# EAGLE design motor board (EAGLE 7.1.0)
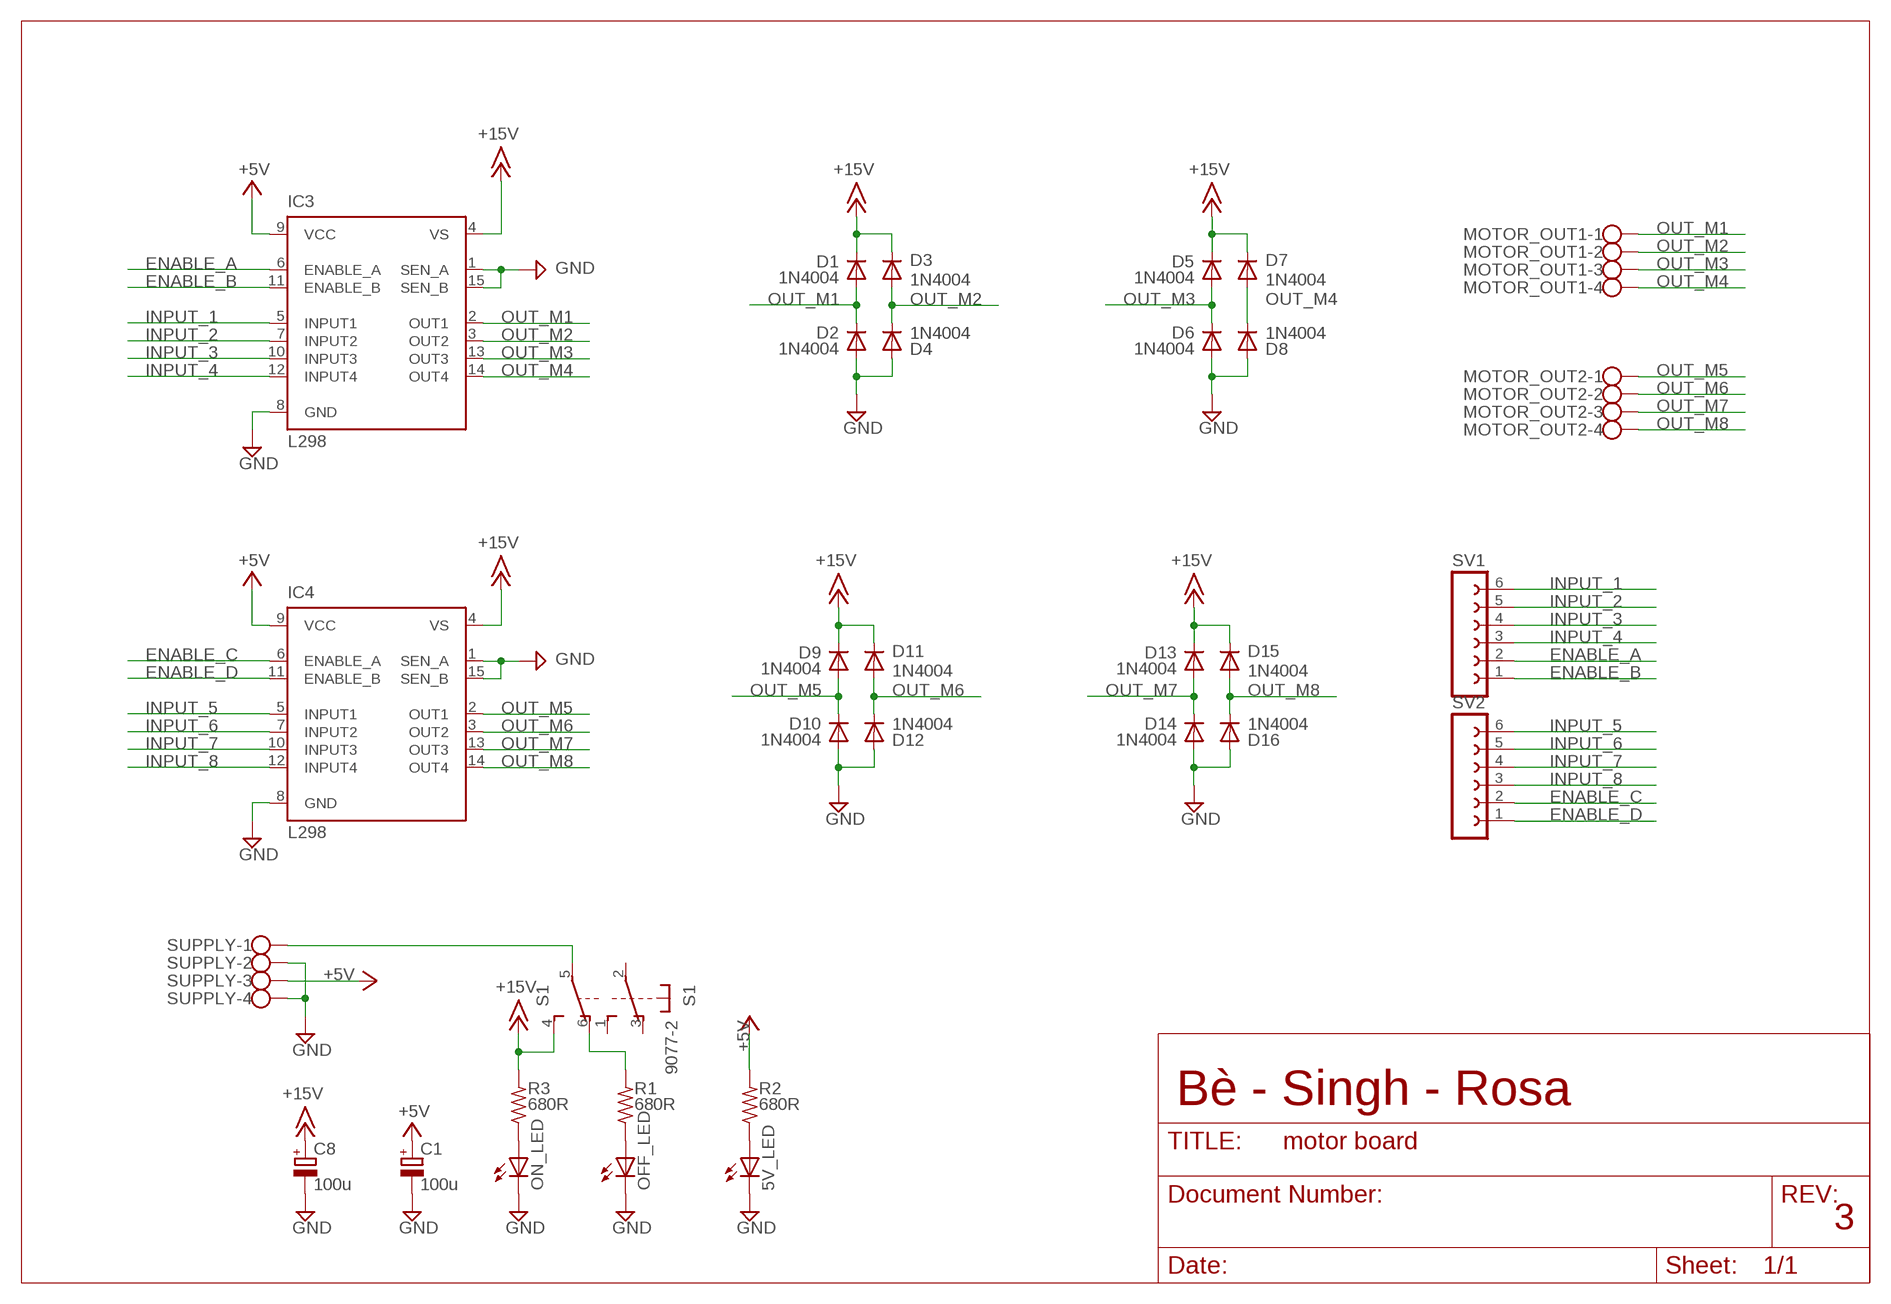
[diagram p0: schematic, sheet 1]

## Parts
5V_LED  LED5MM  [LED5MM]
C1  100u  CPOL-EUE2.5-7  [E2,5-7]
C8  100u  CPOL-EUE3.5-8  [E3,5-8]
D1  1N4004  [DO41-10]
D2  1N4004  [DO41-10]
D3  1N4004  [DO41-10]
D4  1N4004  [DO41-10]
D5  1N4004  [DO41-10]
D6  1N4004  [DO41-10]
D7  1N4004  [DO41-10]
D8  1N4004  [DO41-10]
D9  1N4004  [DO41-10]
D10  1N4004  [DO41-10]
D11  1N4004  [DO41-10]
D12  1N4004  [DO41-10]
D13  1N4004  [DO41-10]
D14  1N4004  [DO41-10]
D15  1N4004  [DO41-10]
D16  1N4004  [DO41-10]
IC3  L298  [MULTIWATT-15]
IC4  L298  [MULTIWATT-15]
MOTOR_OUT1  W237-4  [W237-4]
MOTOR_OUT2  W237-4  [W237-4]
OFF_LED  LED5MM  [LED5MM]
ON_LED  LED5MM  [LED5MM]
R1  680R  R-US_0207/10  [0207/10]
R2  680R  R-US_0207/10  [0207/10]
R3  680R  R-US_0207/10  [0207/10]
S1  9077-2  [9077-2]
SUPPLY  W237-4  [W237-4]
SV1  FE06-1  [FE06]
SV2  FE06-1  [FE06]

## Nets
+5V: C1.+ IC3.9(VCC) IC4.9(VCC) R2.2 SUPPLY.3
+15V: C8.+ D1.C D3.C D5.C D7.C D9.C D11.C D13.C D15.C IC3.4(VS) IC4.4(VS) R3.2 S1.4(2:S)
ENABLE_A: IC3.6(ENABLE_A) SV1.2
ENABLE_B: IC3.11(ENABLE_B) SV1.1
ENABLE_C: IC4.6(ENABLE_A) SV2.2
ENABLE_D: IC4.11(ENABLE_B) SV2.1
GND: 5V_LED.K(C) C1.- C8.- D2.A D4.A D6.A D8.A D10.A D12.A D14.A D16.A IC3.1(SEN_A) IC3.8(GND) IC3.15(SEN_B) IC4.1(SEN_A) IC4.8(GND) IC4.15(SEN_B) OFF_LED.K(C) ON_LED.K(C) SUPPLY.2 SUPPLY.4
INPUT_1: IC3.5(INPUT1) SV1.6
INPUT_2: IC3.7(INPUT2) SV1.5
INPUT_3: IC3.10(INPUT3) SV1.4
INPUT_4: IC3.12(INPUT4) SV1.3
INPUT_5: IC4.5(INPUT1) SV2.6
INPUT_6: IC4.7(INPUT2) SV2.5
INPUT_7: IC4.10(INPUT3) SV2.4
INPUT_8: IC4.12(INPUT4) SV2.3
N$1: ON_LED.A R3.1
N$2: OFF_LED.A R1.1
N$3: 5V_LED.A R2.1
N$4: S1.5(2:P) SUPPLY.1
N$5: R1.2 S1.6(2:O)
OUT_M1: D1.A D2.C IC3.2(OUT1) MOTOR_OUT1.1
OUT_M2: D3.A D4.C IC3.3(OUT2) MOTOR_OUT1.2
OUT_M3: D5.A D6.C IC3.13(OUT3) MOTOR_OUT1.3
OUT_M4: D7.A D8.C IC3.14(OUT4) MOTOR_OUT1.4
OUT_M5: D9.A D10.C IC4.2(OUT1) MOTOR_OUT2.1
OUT_M6: D11.A D12.C IC4.3(OUT2) MOTOR_OUT2.2
OUT_M7: D13.A D14.C IC4.13(OUT3) MOTOR_OUT2.3
OUT_M8: D15.A D16.C IC4.14(OUT4) MOTOR_OUT2.4
Unconnected: S1.1(1:S) S1.2(1:P) S1.3(1:O)

## Notes on the sheet
- Bè - Singh - Rosa
- 3

## Library data of the parts
5V_LED OFF_LED ON_LED = led:LED: LED OSRAM: - CHIPLED LG R971, LG N971, LY N971, LG Q971, LY Q971, LO R971, LY R971 LH N974, LH R974 LS Q976, LO Q976, LY Q976 LO Q996 - Hyper CHIPLED LW Q18S LB Q993, LB Q99A, LB R99A - SideLED LS A670, LO A670, LY A670, LG A670, LP A670 LB A673, LV A673, LT A673, LW A673 LH A674 LY A675 LS A676, LA A676, LO A676, LY A676, LW A676 LS A679, LY A679, LG A679 - Hyper Micro SIDELED® LS Y876, LA Y876, LO Y876, LY Y876 LT Y87S - SmartLED LW L88C, LW L88S LB L89C, LB L89S, LG L890 LS L89K, LO L89K, LY L89K LS L896, LA L896, LO L896, LY L896 - TOPLED LS T670, LO T670, LY T670, LG T670, LP T670 LSG T670, LSP T670, LSY T670, LOP T670, LYG T670 LG T671, LOG T671, LSG T671 LB T673, LV T673, LT T673, LW T673 LH T674 LS T676, LA T676, LO T676, LY T676, LB T676, LH T676, LSB T676, LW T676 LB T67C, LV T67C, LT T67C, LS T67K, LO T67K, LY T67K, LW E67C LS E67B, LA E67B, LO E67B, LY E67B, LB E67C, LV E67C, LT E67C LW T67C LS T679, LY T679, LG T679 LS T770, LO T770, LY T770, LG T770, LP T770 LB T773, LV T773, LT T773, LW T773 LH T774 LS E675, LA E675, LY E675, LS T675 LS T776, LA T776, LO T776, LY T776, LB T776 LHGB T686 LT T68C, LB T68C - Hyper Mini TOPLED® LB M676 - Mini TOPLED Santana® LG M470 LS M47K, LO M47K, LY M47K Source: http://www.osram.convergy.de LUXEON: - LUMILED® LXK2-PW12-R00, LXK2-PW12-S00, LXK2-PW14-U00, LXK2-PW14-V00 LXK2-PM12-R00, LXK2-PM12-S00, LXK2-PM14-U00 LXK2-PE12-Q00, LXK2-PE12-R00, LXK2-PE12-S00, LXK2-PE14-T00, LXK2-PE14-U00 LXK2-PB12-K00, LXK2-PB12-L00, LXK2-PB12-M00, LXK2-PB14-N00, LXK2-PB14-P00, LXK2-PB14-Q00 LXK2-PR12-L00, LXK2-PR12-M00, LXK2-PR14-Q00, LXK2-PR14-R00 LXK2-PD12-Q00, LXK2-PD12-R00, LXK2-PD12-S00 LXK2-PH12-R00, LXK2-PH12-S00 LXK2-PL12-P00, LXK2-PL12-Q00, LXK2-PL12-R00 Source: www.luxeon.com KINGBRIGHT: KA-3528ASYC Source: www.kingbright.com
C1 = ITIS:CPOL-EU: POLARIZED CAPACITOR, European symbol
C8 = rcl:CPOL-EU: POLARIZED CAPACITOR, European symbol
D1-D16 = ITIS:1N4004: DIODE general purpose rectifier, 1 A
IC3 IC4 = st-microelectronics:L298: DUAL FULL-BRIDGE DRIVER
MOTOR_OUT1 MOTOR_OUT2 SUPPLY = con-wago-500:W237-4: WAGO SCREW CLAMP; OC_FARNELL: unknown; OC_NEWARK: unknown
R1-R3 = resistor:R-US_: RESISTOR, American symbol
S1 = switch-misc:9077-2: MARQUARDT SWITCH 9077.0200 Distributor: Buerklin <https://www.buerklin.com/default.asp?event=ShowArtikel%2812G2822%29&l=d&jump=ArtNr_12G2822>
SV1 SV2 = con-lsta:FE06-1: FEMALE HEADER; OC_FARNELL: unknown; OC_NEWARK: unknown

## Board
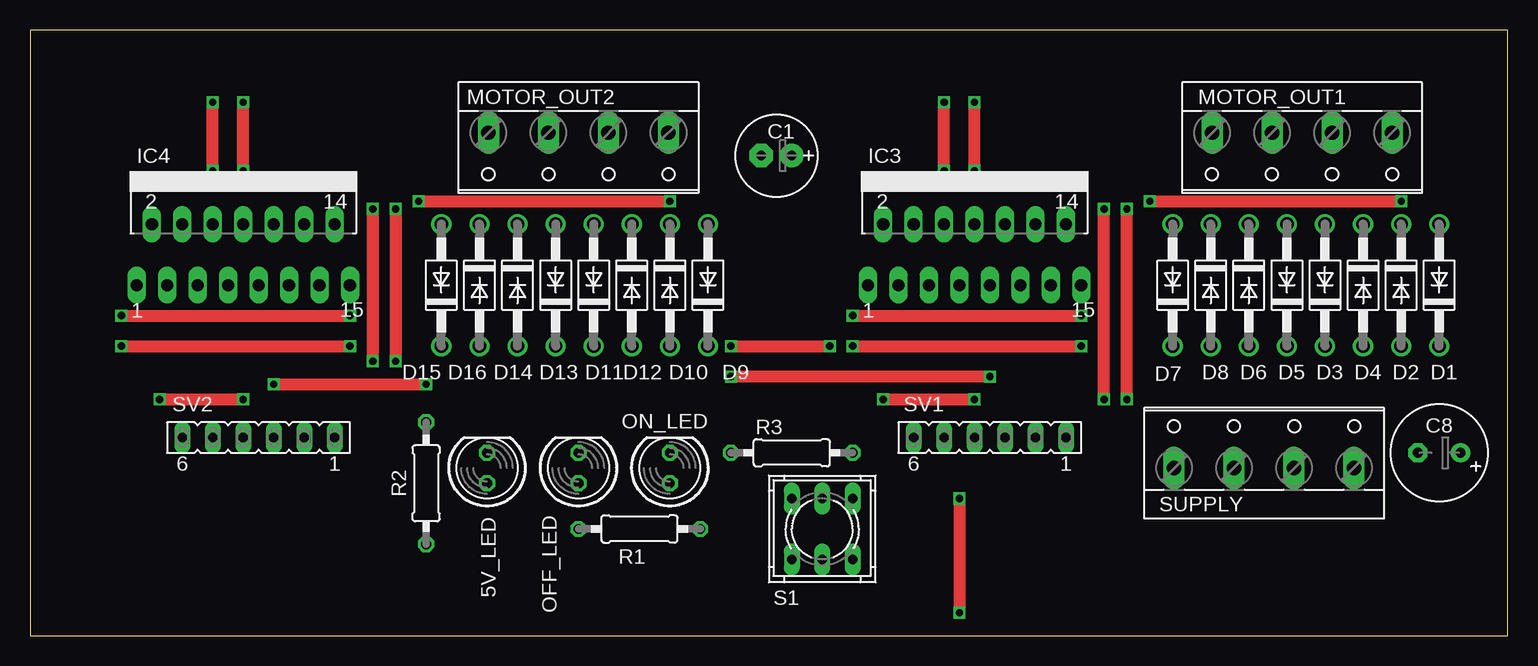
[diagram p1: board, top side]
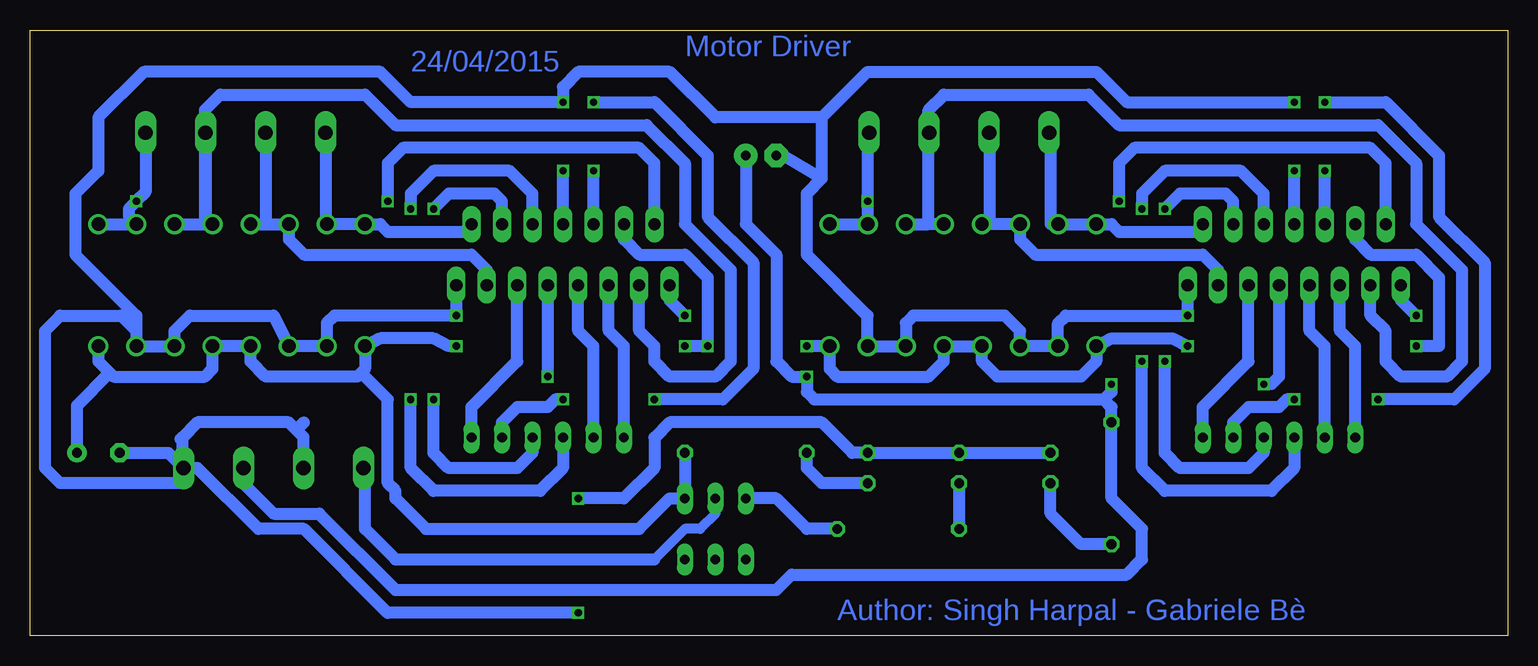
[diagram p2: board, bottom side, seen from below]

Size 123.17 x 50.47 mm. Coordinates in mm from the lower left corner, seen from the top.
Outline: 0,0 123.17,0 123.17,50.47 0,50.47 0,0
Copper layers (1*16): Top 0.035mm / dielectric 1.5mm / Bottom 0.035mm
Design rules "default": minimum track width 10mil, minimum drill 24mil, track to track 8mil, track to pad 8mil, pad to pad 8mil, via to via 8mil, smd to smd 8mil, copper to edge 40mil, drill to drill 8mil, minimum pad ring 10mil, minimum via ring 8mil, stop-mask expansion 4mil, vias tented up to drill 0mil, thermal gap 10mil

### Footprints (pad centres in the part's own frame; a part is rotated, then mirrored left to right if it is on the bottom)
LED5MM = drill 0.813 octagon: A -1.27,0; K 1.27,0
E2,5-7 = drill 0.813 pad 1.93: + -1.27,0 | drill 0.813 pad 1.93 octagon: - 1.27,0
E3,5-8 = drill 0.813 pad 1.6: + -1.778,0 | drill 0.813 pad 1.6 octagon: - 1.778,0
DO41-10 = drill 1.118: A 5.08,0; C -5.08,0
MULTIWATT-15 = drill 1.016 long: 1 -8.89,-7.62; 2 -7.62,-2.54; 3 -6.35,-7.62; 4 -5.08,-2.54; 5 -3.81,-7.62; 6 -2.54,-2.54; 7 -1.27,-7.62; 8 0,-2.54; 9 1.27,-7.62; 10 2.54,-2.54; 11 3.81,-7.62; 12 5.08,-2.54; 13 6.35,-7.62; 14 7.62,-2.54; 15 8.89,-7.62
W237-4 = drill 1.194 long: 1 -7.5,-1.27; 2 -2.5,-1.27; 3 2.5,-1.27; 4 7.5,-1.27
0207/10 = drill 0.813 octagon: 1 -5.08,0; 2 5.08,0
9077-2 = drill 0.813 long: 1 -2.54,2.54; 2 0,2.54; 3 2.54,2.54; 4 -2.54,-2.54; 5 0,-2.54; 6 2.54,-2.54
FE06 = drill 0.813 long: 1 -6.35,0; 2 -3.81,0; 3 -1.27,0; 4 1.27,0; 5 3.81,0; 6 6.35,0

### Placement (x,y rotation side)
5V_LED  38.1,13.97 90 top
C1  62.23,40.01 180 top
C8  117.47,15.24 180 top
D1  117.47,29.21 90 top
D2  114.3,29.21 270 top
D3  107.95,29.21 90 top
D4  111.12,29.21 270 top
D5  104.78,29.21 90 top
D6  101.6,29.21 270 top
D7  95.25,29.21 90 top
D8  98.42,29.21 270 top
D9  56.52,29.21 90 top
D10  53.34,29.21 270 top
D11  46.99,29.21 90 top
D12  50.16,29.21 270 top
D13  43.81,29.21 90 top
D14  40.64,29.21 270 top
D15  34.29,29.21 90 top
D16  37.47,29.21 270 top
IC3  78.74,36.83 0 top
IC4  17.78,36.83 0 top
MOTOR_OUT1  106.05,40.64 180 top
MOTOR_OUT2  45.72,40.64 180 top
OFF_LED  45.72,13.97 90 top
ON_LED  53.34,13.97 90 top
R1  50.8,8.89 0 top
R2  33.02,12.7 90 top
R3  63.5,15.24 0 top
S1  66.04,8.89 180 top
SUPPLY  102.87,15.24 0 top
SV1  80.01,16.51 180 top
SV2  19.05,16.51 180 top

### Tracks (layer width: path | path; a pad name or v marks a point on that pad's centre or on a via)
+5V  (via drill 0.6)
  Top 1.016: v20.32,20.95 v33.02,20.95 | v80.01,21.59 v58.42,21.59
  Bottom 1.016: IC4.9 19.05,21.59 19.68,20.95 v20.32,20.95 | IC3.9 v80.01,21.59 | 33.66,19.68 57.78,19.68 58.42,20.32 v58.42,21.59 59.69,21.59 60.96,22.86 60.96,31.75 63.5,34.29 C1.+ | 33.66,19.68 33.02,20.32 v33.02,20.95 | SUPPLY.3 105.37,12.66 102.87,10.16 99.06,10.16 92.71,3.81 60.96,3.81 59.69,5.08 31.75,5.08 30.48,6.35 30.48,8.89 33.02,11.43 R2.2 33.02,19.05 33.66,19.68
+15V  (via drill 0.6)
  Top 1.016: v7.62,24.13 v26.67,24.13 | v68.58,24.13 v87.63,24.13 | v58.42,24.13 v66.67,24.13
  Bottom 1.016: IC4.4 12.7,33.02 11.43,31.75 7.62,31.75 5.71,29.84 5.71,24.13 v7.62,24.13 | v26.67,24.13 27.94,24.77 33.02,24.77 D15.C 34.29,22.86 35.56,21.59 42.55,21.59 43.81,22.86 D13.C D11.C 46.99,22.86 48.26,21.59 55.88,21.59 56.52,22.23 D9.C v58.42,24.13 | 95.57,21.91 95.25,22.23 D7.C 93.98,24.77 89.53,24.77 88.27,24.13 v87.63,24.13 | 95.57,21.91 95.89,21.59 103.5,21.59 104.78,22.86 D5.C D3.C 107.95,22.23 108.58,21.59 116.2,21.59 116.52,21.91 | D1.C 117.47,22.86 116.52,21.91 | IC3.4 73.66,33.02 72.39,31.75 68.58,31.75 66.67,29.84 v66.67,24.13 v68.58,24.13 | 95.57,21.91 93.34,19.68 93.34,12.7 92.71,12.06 92.71,11.43 90.17,8.89 72.39,8.89 69.85,11.43 S1.4 R3.2 | C8.+ 119.25,19.18 116.52,21.91
ENABLE_A  (via drill 0.6)
  Top 1.016: v76.2,38.73 v76.2,44.45 | v71.12,19.68 v78.74,19.68
  Bottom 1.016: IC3.6 v76.2,38.73 | v76.2,44.45 71.12,44.45 66.67,40.01 66.67,34.92 62.87,31.11 62.87,22.23 65.41,19.68 v71.12,19.68 | v78.74,19.68 79.38,19.68 80.01,19.05 82.55,19.05 83.82,17.78 SV1.2
ENABLE_B
  Bottom 1.016: SV1.1 86.36,19.05 82.55,22.86 IC3.11
ENABLE_C  (via drill 0.6)
  Top 1.016: v15.24,38.73 v15.24,44.45 | v10.79,19.68 v17.78,19.68
  Bottom 1.016: IC4.6 v15.24,38.73 | v15.24,44.45 10.16,44.45 5.71,40.01 5.71,34.92 1.91,31.11 1.91,22.23 4.45,19.68 v10.79,19.68 | v17.78,19.68 18.41,19.68 19.05,19.05 21.59,19.05 22.86,17.78 SV2.2
ENABLE_D
  Bottom 1.016: SV2.1 25.4,19.05 21.59,22.86 IC4.11
GND  (via drill 0.6)
  Top 1.016: v7.62,26.67 v26.67,26.67 | v17.78,38.73 v17.78,44.45 | v68.58,26.67 v87.63,26.67 | v78.74,38.73 v78.74,44.45 | v77.47,11.43 v77.47,1.91
  Bottom 1.016: IC4.15 v26.67,26.67 36.83,26.67 37.47,26.04 D16.A D14.A 40.64,25.4 41.91,26.67 49.53,26.67 50.16,26.04 D12.A D10.A 53.34,26.67 58.42,31.75 58.42,36.83 57.15,38.1 | IC4.1 8.89,27.94 v7.62,26.67 | 57.15,43.18 53.34,46.99 34.29,46.99 31.75,44.45 v17.78,44.45 | IC4.8 v17.78,38.73 | IC3.15 v87.63,26.67 97.79,26.67 98.42,26.04 D8.A D6.A 102.87,26.67 109.86,26.67 111.12,25.4 D4.A D2.A 114.3,25.4 | IC3.1 69.85,27.94 v68.58,26.67 | IC3.8 v78.74,38.73 | 114.3,25.4 114.3,26.67 119.38,31.75 119.38,36.83 117.47,38.73 117.47,43.18 113.67,46.99 93.98,46.99 91.44,44.45 v78.74,44.45 78.74,45.72 77.47,46.99 69.85,46.99 66.04,43.18 57.15,43.18 | 57.15,38.1 57.15,43.18 | C1.- 60.33,40.01 57.15,38.1 | SUPPLY.2 100.37,16.55 100.97,17.14 | 100.97,17.14 101.6,17.78 109.22,17.78 110.49,16.51 | 110.49,13.97 SUPPLY.4 | 5V_LED.K OFF_LED.K ON_LED.K 54.61,15.24 57.15,17.78 69.85,17.78 71.12,16.51 71.12,13.97 73.66,11.43 v77.47,11.43 | 100.33,17.78 100.97,17.14 | 110.62,16.38 110.49,16.51 | C8.- 111.64,15.24 SUPPLY.4 | v77.47,1.91 93.34,1.91 100.33,8.89 104.14,8.89 109.22,13.97 SUPPLY.4 | 110.49,16.51 110.49,13.97 | 110.49,13.97 110.49,12.7 120.65,12.7 121.92,13.97 121.92,25.4 120.65,26.67 115.57,26.67 114.3,25.4
INPUT_1
  Bottom 1.016: SV1.6 73.66,24.13 74.93,25.4 IC3.5
INPUT_2
  Bottom 1.016: SV1.5 76.2,24.13 77.47,25.4 IC3.7
INPUT_3  (via drill 0.6)
  Top 1.016: v91.44,19.68 v91.44,35.56
  Bottom 1.016: IC3.10 81.28,36.83 83.19,38.73 89.53,38.73 91.44,36.83 v91.44,35.56 | SV1.4 78.74,13.97 80.64,12.06 89.53,12.06 91.44,13.97 v91.44,19.68
INPUT_4  (via drill 0.6)
  Top 1.016: v89.53,19.68 v89.53,35.56
  Bottom 1.016: IC3.12 83.82,36.2 84.45,36.83 88.27,36.83 v89.53,35.56 | SV1.3 81.28,15.24 82.55,13.97 88.27,13.97 89.53,15.24 v89.53,19.68
INPUT_5
  Bottom 1.016: SV2.6 12.7,24.13 13.97,25.4 IC4.5
INPUT_6
  Bottom 1.016: SV2.5 15.24,24.13 16.51,25.4 IC4.7
INPUT_7  (via drill 0.6)
  Top 1.016: v30.48,35.56 v30.48,22.86
  Bottom 1.016: IC4.10 20.32,36.83 22.23,38.73 28.57,38.73 30.48,36.83 v30.48,35.56 | SV2.4 17.78,13.97 19.68,12.06 28.57,12.06 30.48,13.97 v30.48,22.86
INPUT_8  (via drill 0.6)
  Top 1.016: v28.57,35.56 v28.57,22.86
  Bottom 1.016: IC4.12 22.86,36.2 23.5,36.83 27.3,36.83 v28.57,35.56 | SV2.3 20.32,15.24 21.59,13.97 27.3,13.97 28.57,15.24 v28.57,22.86
N$1
  Bottom 1.016: ON_LED.A 57.15,12.7 58.42,13.97 R3.1
N$2
  Bottom 1.016: OFF_LED.A R1.1
N$3
  Bottom 1.016: R2.1 35.56,7.62 38.1,10.16 5V_LED.A
N$4
  Bottom 0.813: 71.12,6.35 68.58,8.89 67.31,8.89 66.04,10.16 S1.5
  Bottom 1.016: 95.25,13.97 95.25,14.09 | 95.25,15.24 95.25,14.09 | 95.25,14.09 SUPPLY.1 95.25,13.97 | 95.25,13.97 95.25,8.89 92.71,6.35 71.12,6.35
N$5
  Bottom 1.016: R1.2 58.42,8.89 60.96,11.43 S1.6
OUT_M1  (via drill 0.6)
  Top 1.016: v93.34,36.2 v114.3,36.2
  Bottom 1.016: D1.A D2.C 114.94,34.92 114.94,35.56 v114.3,36.2 113.55,36.95 MOTOR_OUT1.1 | IC3.2 71.12,39.37 72.39,40.64 92.08,40.64 93.34,39.37 v93.34,36.2
OUT_M2
  Bottom 1.016: D4.C 108.58,34.29 | MOTOR_OUT1.2 108.55,34.33 108.58,34.29 | D3.A 108.58,34.29 | 108.58,34.29 108.58,43.81 107.31,45.09 95.25,45.09 92.71,42.55 71.75,42.55 68.58,39.37 68.58,34.29 64.77,30.48 64.77,22.86 66.04,21.59 69.85,21.59 71.12,22.86 71.12,24.13 72.39,25.4 IC3.3
OUT_M3
  Bottom 1.016: D5.A 103.5,34.29 | 103.5,34.29 D6.C 101.6,33.02 100.33,31.75 86.36,31.75 85.09,30.48 IC3.13 | MOTOR_OUT1.3 103.55,34.33 103.5,34.29
OUT_M4
  Bottom 1.016: MOTOR_OUT1.4 98.55,34.41 D8.C D7.A 93.98,34.29 93.34,33.66 87,33.66 IC3.14
OUT_M5  (via drill 0.6)
  Top 1.016: v32.38,36.2 v53.34,36.2
  Bottom 1.016: D9.A D10.C v53.34,36.2 53.34,41.91 MOTOR_OUT2.1 | IC4.2 10.16,39.37 11.43,40.64 31.11,40.64 32.38,39.37 v32.38,36.2
OUT_M6
  Bottom 1.016: D12.C 48.26,34.29 | MOTOR_OUT2.2 48.26,41.91 | D11.A 48.26,34.29 | 48.26,34.29 48.26,41.91 | 48.26,41.91 48.26,43.81 46.99,45.09 34.92,45.09 32.38,42.55 10.79,42.55 7.62,39.37 7.62,34.29 3.81,30.48 3.81,22.86 5.08,21.59 8.89,21.59 10.16,22.86 10.16,25.4 11.43,26.67 IC4.3
OUT_M7
  Bottom 1.016: 43.18,34.29 D14.C 40.64,33.02 39.37,31.75 25.4,31.75 24.13,30.48 IC4.13 | 43.18,34.29 D13.A | MOTOR_OUT2.3 43.18,41.91 43.18,34.29
OUT_M8
  Bottom 1.016: MOTOR_OUT2.4 38.1,41.91 38.1,34.29 D16.C D15.A 33.02,34.29 32.38,33.66 26.04,33.66 IC4.14

### Text on the board
Bottom: Motor Driver | 24/04/2015 | Author: Singh Harpal - Gabriele Bè